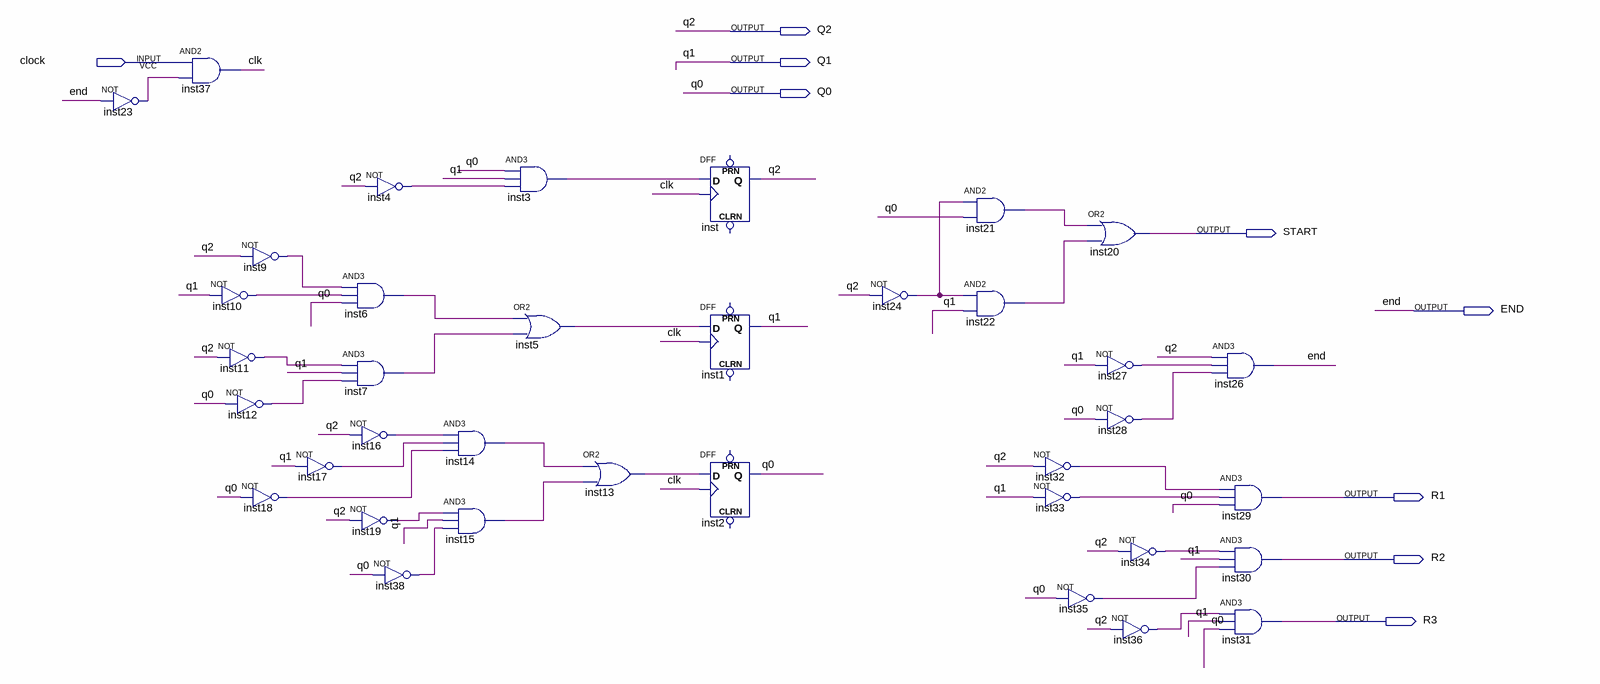
[diagram p0: schematic sheet]
// Quartus schematic Maquina_de_estados_V2_TP3.bdf as structural Verilog: 37 symbols, 9 pins
module Maquina_de_estados_V2_TP3 (
  input  clock,
  output Q2,
  output Q1,
  output Q0,
  output START,
  output END,
  output R1,
  output R2,
  output R3
);

  wire clk, inst3_out, inst4_out, inst5_out, inst6_out, inst7_out, inst9_out, inst10_out, inst11_out,
       inst12_out, inst13_out, inst14_out, inst15_out, inst16_out, inst17_out, inst18_out, inst19_out,
       inst21_out, inst22_out, inst23_out, inst24_out, inst27_out, inst28_out, inst32_out, inst33_out,
       inst34_out, inst35_out, inst36_out, inst38_out;

  not inst23 (inst23_out, END);
  and inst37 (clk, clock, inst23_out);
  not inst10 (inst10_out, Q1);
  not inst9 (inst9_out, Q2);
  not inst11 (inst11_out, Q2);
  not inst12 (inst12_out, Q0);
  not inst18 (inst18_out, Q0);
  not inst17 (inst17_out, Q1);
  not inst4 (inst4_out, Q2);
  and inst6 (inst6_out, inst9_out, inst10_out, Q0);
  and inst7 (inst7_out, inst11_out, Q1, inst12_out);
  not inst16 (inst16_out, Q2);
  not inst19 (inst19_out, Q2);
  not inst38 (inst38_out, Q0);
  and inst14 (inst14_out, inst16_out, inst17_out, inst18_out);
  and inst15 (inst15_out, inst19_out, Q1, inst38_out);
  and inst3 (inst3_out, Q0, Q1, inst4_out);
  or inst5 (inst5_out, inst6_out, inst7_out);
  or inst13 (inst13_out, inst14_out, inst15_out);
  DFF inst (.CLK(clk), .D(inst3_out), .Q(Q2));  // open: CLRN, PRN
  DFF inst1 (.CLK(clk), .D(inst5_out), .Q(Q1));  // open: CLRN, PRN
  DFF inst2 (.CLK(clk), .D(inst13_out), .Q(Q0));  // open: CLRN, PRN
  not inst24 (inst24_out, Q2);
  and inst21 (inst21_out, inst24_out, Q0);
  and inst22 (inst22_out, inst24_out, Q1);
  not inst32 (inst32_out, Q2);
  not inst33 (inst33_out, Q1);
  not inst35 (inst35_out, Q0);
  or inst20 (START, inst21_out, inst22_out);
  not inst27 (inst27_out, Q1);
  not inst28 (inst28_out, Q0);
  not inst34 (inst34_out, Q2);
  not inst36 (inst36_out, Q2);
  and inst26 (END, Q2, inst27_out, inst28_out);
  and inst29 (R1, inst32_out, inst33_out, Q0);
  and inst30 (R2, inst34_out, Q1, inst35_out);
  and inst31 (R3, inst36_out, Q1, Q0);
endmodule
